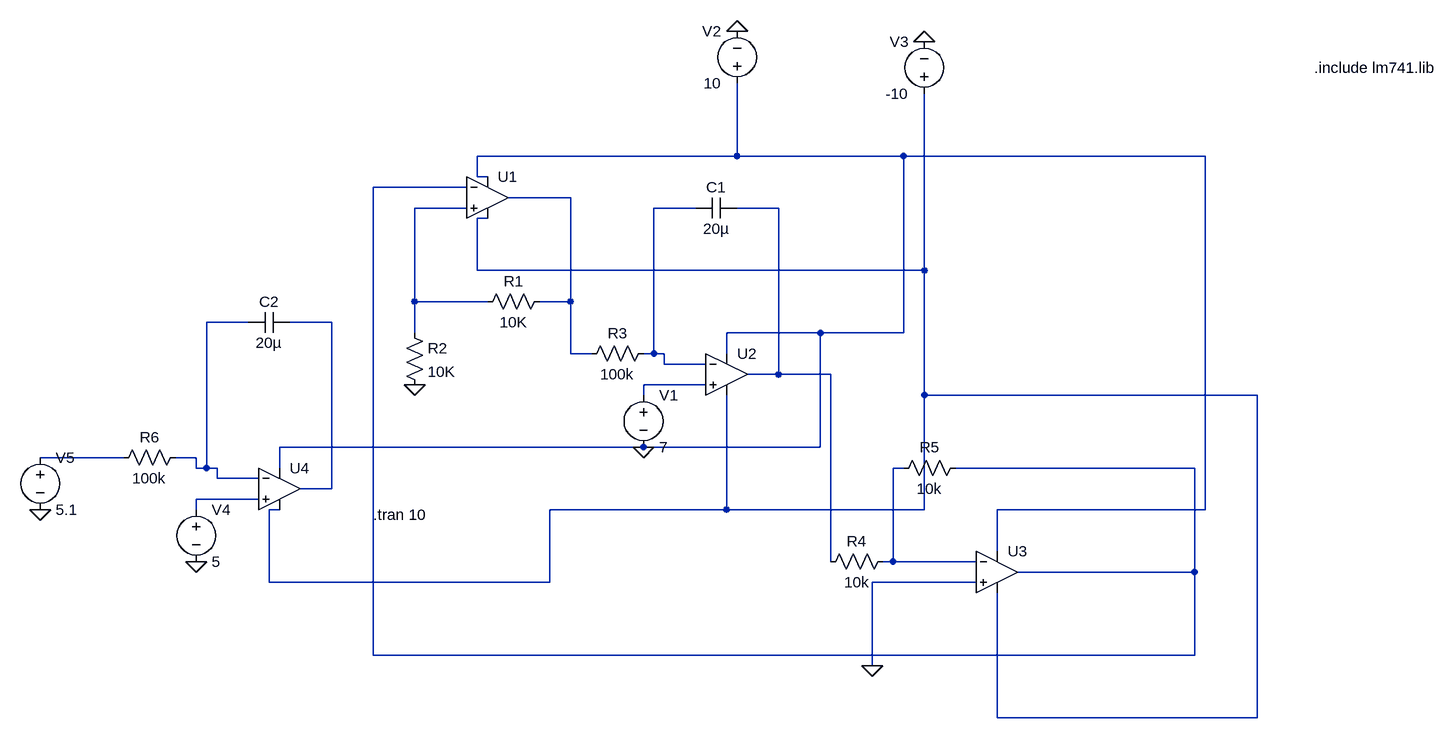
[diagram p0: schematic VCO_trail_works.asc]
VCO_trail_works.asc, the LTspice schematic file:
Version 4.1
SHEET 1 1676 996
WIRE 496 128 496 16
WIRE 496 128 96 128
WIRE 752 128 496 128
WIRE 1216 128 752 128
WIRE 96 160 96 128
WIRE 112 160 96 160
WIRE 80 176 -64 176
WIRE 240 192 144 192
WIRE 80 208 0 208
WIRE 432 208 368 208
WIRE 560 208 496 208
WIRE 112 224 96 224
WIRE 96 304 96 224
WIRE 784 304 784 32
WIRE 784 304 96 304
WIRE 0 352 0 208
WIRE 112 352 0 352
WIRE 240 352 240 192
WIRE 240 352 192 352
WIRE -256 384 -320 384
WIRE -128 384 -192 384
WIRE 0 400 0 352
WIRE 624 400 480 400
WIRE 752 400 752 128
WIRE 752 400 624 400
WIRE 240 432 240 352
WIRE 272 432 240 432
WIRE 368 432 368 208
WIRE 368 432 352 432
WIRE 384 432 368 432
WIRE 480 432 480 400
WIRE 384 448 384 432
WIRE 448 448 384 448
WIRE 560 464 560 208
WIRE 560 464 512 464
WIRE 640 464 560 464
WIRE 448 480 352 480
WIRE 352 496 352 480
WIRE 784 496 784 304
WIRE 1296 496 784 496
WIRE 352 576 -208 576
WIRE 624 576 624 400
WIRE 624 576 352 576
WIRE -448 592 -576 592
WIRE -336 592 -368 592
WIRE -336 608 -336 592
WIRE -320 608 -320 384
WIRE -320 608 -336 608
WIRE -304 608 -320 608
WIRE -208 608 -208 576
WIRE 752 608 736 608
WIRE 1200 608 832 608
WIRE -304 624 -304 608
WIRE -240 624 -304 624
WIRE -128 640 -128 384
WIRE -128 640 -176 640
WIRE -240 656 -336 656
WIRE -336 672 -336 656
WIRE -208 672 -224 672
WIRE 480 672 480 496
WIRE 480 672 208 672
WIRE 784 672 784 496
WIRE 784 672 480 672
WIRE 1216 672 1216 128
WIRE 1216 672 896 672
WIRE 896 736 896 672
WIRE 640 752 640 464
WIRE 736 752 736 608
WIRE 736 752 720 752
WIRE 864 752 736 752
WIRE 1200 768 1200 608
WIRE 1200 768 928 768
WIRE -224 784 -224 672
WIRE 208 784 208 672
WIRE 208 784 -224 784
WIRE 864 784 704 784
WIRE -64 896 -64 176
WIRE 1200 896 1200 768
WIRE 1200 896 -64 896
WIRE 704 912 704 784
WIRE 896 992 896 800
WIRE 1296 992 1296 496
WIRE 1296 992 896 992
FLAG 352 576 0
FLAG 0 480 0
FLAG 496 -64 0
FLAG 784 -48 0
FLAG 704 912 0
FLAG -336 752 0
FLAG -576 672 0
SYMBOL res -16 384 R0
SYMATTR InstName R2
SYMATTR Value 10K
SYMBOL res 208 336 R90
WINDOW 0 0 56 VBottom 2
WINDOW 3 32 56 VTop 2
SYMATTR InstName R1
SYMATTR Value 10K
SYMBOL res 368 416 R90
WINDOW 0 0 56 VBottom 2
WINDOW 3 32 56 VTop 2
SYMATTR InstName R3
SYMATTR Value 100k
SYMBOL cap 496 192 R90
WINDOW 0 0 32 VBottom 2
WINDOW 3 32 32 VTop 2
SYMATTR InstName C1
SYMATTR Value 20µ
SYMBOL voltage 352 480 R0
WINDOW 123 0 0 Left 0
WINDOW 39 0 0 Left 0
SYMATTR InstName V1
SYMATTR Value 7
SYMBOL voltage 496 32 R180
WINDOW 0 24 96 Left 2
WINDOW 3 24 16 Left 2
WINDOW 123 0 0 Left 0
WINDOW 39 0 0 Left 0
SYMATTR InstName V2
SYMATTR Value 10
SYMBOL voltage 784 48 R180
WINDOW 0 24 96 Left 2
WINDOW 3 24 16 Left 2
WINDOW 123 0 0 Left 0
WINDOW 39 0 0 Left 0
SYMATTR InstName V3
SYMATTR Value -10
SYMBOL res 736 736 R90
WINDOW 0 0 56 VBottom 2
WINDOW 3 32 56 VTop 2
SYMATTR InstName R4
SYMATTR Value 10k
SYMBOL res 848 592 R90
WINDOW 0 0 56 VBottom 2
WINDOW 3 32 56 VTop 2
SYMATTR InstName R5
SYMATTR Value 10k
SYMBOL OpAmps\\UniversalOpAmp2 112 192 R0
SYMATTR InstName U1
SYMATTR Value2 Avol=200k GBW=1Meg Slew=0.5Meg
SYMATTR SpiceLine Ilimit=25m Rail=2 Vos=2m
SYMATTR SpiceLine2 En=20n Enk=100 In=0.5p Ink=100 Rin=2Meg
SYMBOL OpAmps\\UniversalOpAmp2 896 768 R0
SYMATTR InstName U3
SYMATTR Value2 Avol=200k GBW=1Meg Slew=0.5Meg
SYMATTR SpiceLine Ilimit=25m Rail=2 Vos=2m
SYMATTR SpiceLine2 En=20n Enk=100 In=0.5p Ink=100 Rin=2Meg
SYMBOL OpAmps\\UniversalOpAmp2 480 464 R0
SYMATTR InstName U2
SYMATTR Value2 Avol=200k GBW=1Meg Slew=0.5Meg
SYMATTR SpiceLine Ilimit=25m Rail=2 Vos=2m
SYMATTR SpiceLine2 En=20n Enk=100 In=0.5p Ink=100 Rin=2Meg
SYMBOL cap -192 368 R90
WINDOW 0 0 32 VBottom 2
WINDOW 3 32 32 VTop 2
SYMATTR InstName C2
SYMATTR Value 20µ
SYMBOL voltage -336 656 R0
WINDOW 123 0 0 Left 0
WINDOW 39 0 0 Left 0
SYMATTR InstName V4
SYMATTR Value 5
SYMBOL OpAmps\\UniversalOpAmp2 -208 640 R0
SYMATTR InstName U4
SYMATTR Value2 Avol=200k GBW=1Meg Slew=0.5Meg
SYMATTR SpiceLine Ilimit=25m Rail=2 Vos=2m
SYMATTR SpiceLine2 En=20n Enk=100 In=0.5p Ink=100 Rin=2Meg
SYMBOL res -352 576 R90
WINDOW 0 0 56 VBottom 2
WINDOW 3 32 56 VTop 2
SYMATTR InstName R6
SYMATTR Value 100k
SYMBOL voltage -576 576 R0
WINDOW 123 0 0 Left 0
WINDOW 39 0 0 Left 0
SYMATTR InstName V5
SYMATTR Value 5.1
TEXT -64 680 Left 2 !.tran 10
TEXT 1384 -8 Left 2 !.include lm741.lib

The netlist it stands for:
* VCO_trail_works.asc
R2 N003 0 10K
R1 N002 N003 10K
R3 N004 N002 100k
C1 N005 N004 20µ
V1 N009 0 7
V2 0 0 10
V3 N006 0 -10
R4 N011 N005 10k
R5 N001 N011 10k
X§U1 N003 N001 0 N006 N002 level2 Avol=200k GBW=1Meg Slew=0.5Meg Ilimit=25m Rail=2 Vos=2m En=20n Enk=100 In=0.5p Ink=100 Rin=2Meg  ; pins In+ In- V+ V- OUT
X§U3 0 N011 0 N006 N001 level2 Avol=200k GBW=1Meg Slew=0.5Meg Ilimit=25m Rail=2 Vos=2m En=20n Enk=100 In=0.5p Ink=100 Rin=2Meg  ; pins In+ In- V+ V- OUT
X§U2 N009 N004 0 N006 N005 level2 Avol=200k GBW=1Meg Slew=0.5Meg Ilimit=25m Rail=2 Vos=2m En=20n Enk=100 In=0.5p Ink=100 Rin=2Meg  ; pins In+ In- V+ V- OUT
C2 N008 N007 20µ
V4 N012 0 5
X§U4 N012 N007 0 N006 N008 level2 Avol=200k GBW=1Meg Slew=0.5Meg Ilimit=25m Rail=2 Vos=2m En=20n Enk=100 In=0.5p Ink=100 Rin=2Meg  ; pins In+ In- V+ V- OUT
R6 N007 N010 100k
V5 N010 0 5.1
.tran 10
.include lm741.lib
.lib UniversalOpAmp2.lib
.backanno
.end